# Altium schematic sheet mcuCore.SchDoc
size A4
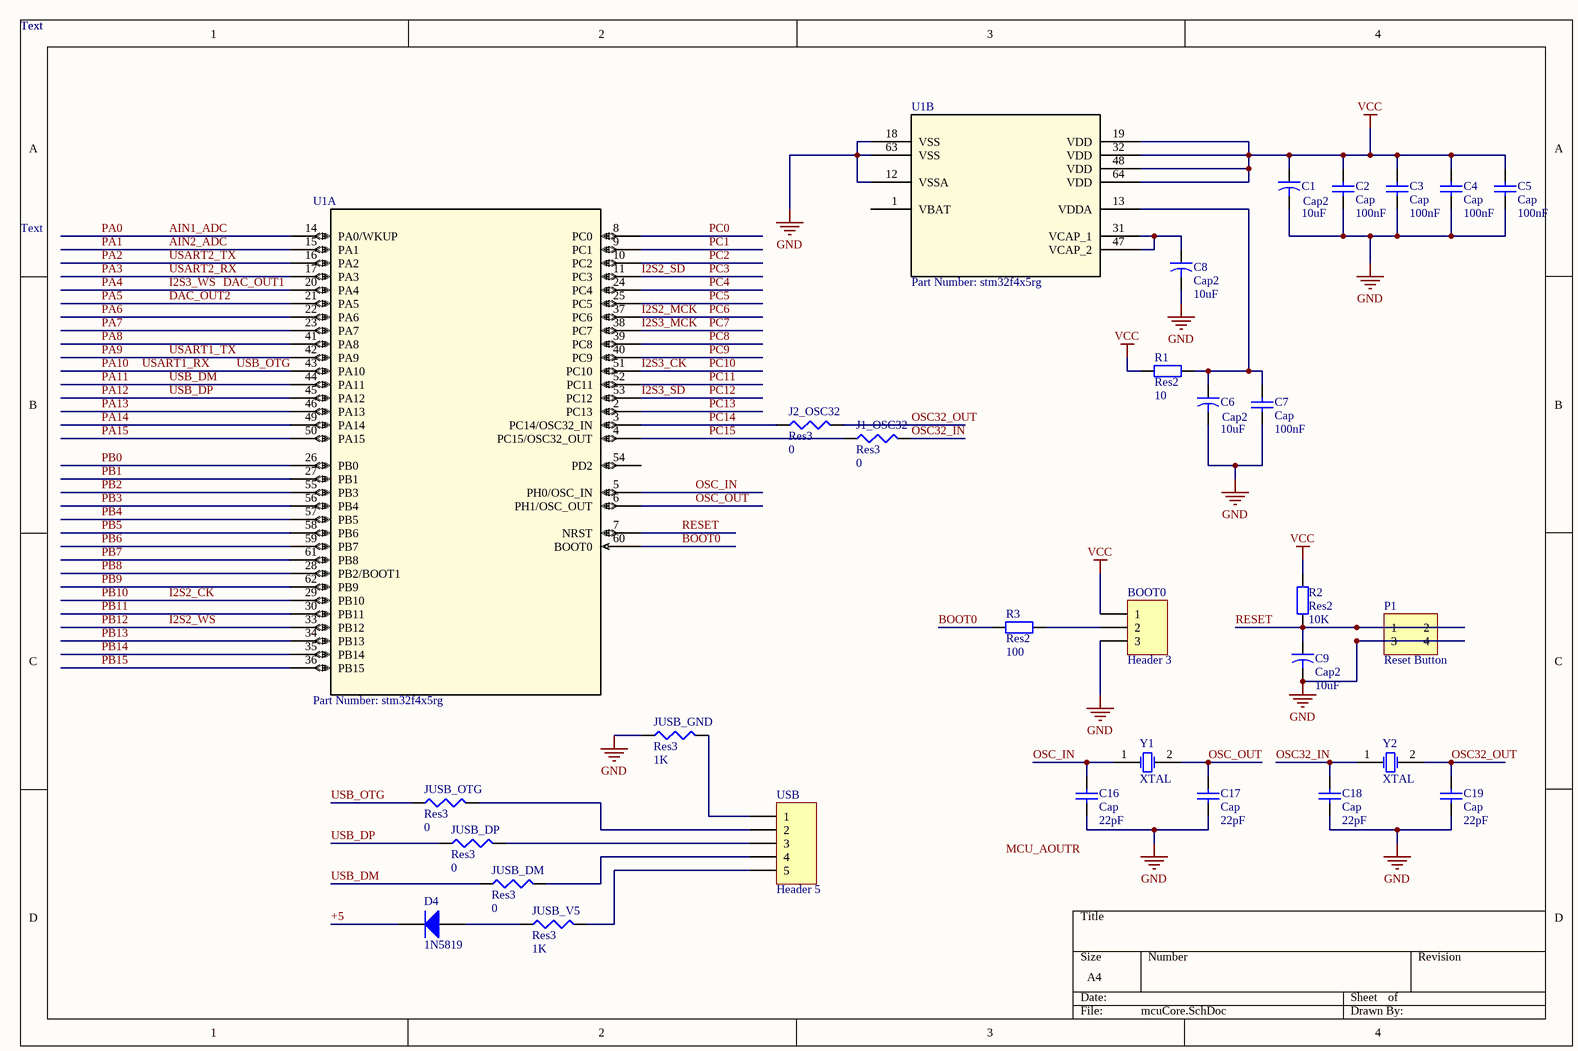
[diagram p0: mcuCore.SchDoc]

## Parts
BOOT0  Header 3  [HDR1X3]
C1  Cap2  value 10uF  [Cap5x10]
C2  Cap  value 100nF  [1608[0603]]
C3  Cap  value 100nF  [1608[0603]]
C4  Cap  value 100nF  [1608[0603]]
C5  Cap  value 100nF  [1608[0603]]
C6  Cap2  value 10uF  [Cap5x10]
C7  Cap  value 100nF  [1608[0603]]
C8  Cap2  value 10uF  [Cap5x10]
C9  Cap2  value 10uF  [Cap5x10]
C16  Cap  value 22pF  [1608[0603]]
C17  Cap  value 22pF  [1608[0603]]
C18  Cap  value 22pF  [1608[0603]]
C19  Cap  value 22pF  [1608[0603]]
D4  1N5819  [425]
J1_OSC32  Res3  value 0  [JUMPER2]
J2_OSC32  Res3  value 0  [JUMPER2]
JUSB_DM  Res3  value 0  [JUMPER2]
JUSB_DP  Res3  value 0  [JUMPER2]
JUSB_GND  Res3  value 1K  [JUMPER2]
JUSB_OTG  Res3  value 0  [JUMPER2]
JUSB_V5  Res3  value 1K  [JUMPER2]
P1  Reset Button  [DC_Jack]
R1  Res2  value 10  [AXIAL-0.4]
R2  Res2  value 10K  [J1-0603]
R3  Res2  value 100  [J1-0603]
U1  Part Number: stm32f4x5rg  [LQFP64-10x10mm]  (parts A,B of 2)
USB  Header 5  [Micro_USB]
Y1  XTAL  [XTAL_8M]
Y2  XTAL  [XTAL_32k]

## Nets
GND: BOOT0.3 C1.2 C2.1 C3.1 C4.1 C5.1 C6.2 C7.1 C8.2 C9.2 C16.1 C17.1 C18.1 C19.1 JUSB_GND.1 P1.3 P1.4 U1.12(VSSA) U1.18(VSS) U1.63(VSS)
VCC: BOOT0.1 C1.1 C2.2 C3.2 C4.2 C5.2 R1.1 R2.2 U1.19(VDD) U1.32(VDD) U1.48(VDD) U1.64(VDD)
+5: D4.2(K)
AIN1_ADC: U1.14(PA0/WKUP)  [also labelled PA0]
AIN2_ADC: U1.15(PA1)  [also labelled PA1]
BOOT0: R3.1 U1.60(BOOT0)
DAC_OUT1: U1.20(PA4)  [also labelled I2S3_WS, PA4]
DAC_OUT2: U1.21(PA5)  [also labelled PA5]
I2S2_CK: U1.29(PB10)  [also labelled PB10]
I2S2_MCK: U1.37(PC6)  [also labelled PC6]
I2S2_SD: U1.11(PC3)  [also labelled PC3]
I2S2_WS: U1.33(PB12)  [also labelled PB12]
I2S3_CK: U1.51(PC10)  [also labelled PC10]
I2S3_MCK: U1.38(PC7)  [also labelled PC7]
I2S3_SD: U1.53(PC12)  [also labelled PC12]
OSC32_IN: C18.2 J1_OSC32.2 Y2.1(OSC1)
OSC32_OUT: C19.2 J2_OSC32.2 Y2.2(OSC2)
OSC_IN: C16.2 U1.5(PH0/OSC_IN) Y1.1(OSC1)
OSC_OUT: C17.2 U1.6(PH1/OSC_OUT) Y1.2(OSC2)
PA2: U1.16(PA2)  [also labelled USART2_TX]
PA3: U1.17(PA3)  [also labelled USART2_RX]
PA6: U1.22(PA6)
PA7: U1.23(PA7)
PA8: U1.41(PA8)
PA9: U1.42(PA9)  [also labelled USART1_TX]
PA10: JUSB_OTG.1 U1.43(PA10)  [also labelled USART1_RX, USB_OTG]
PA11: JUSB_DM.1 U1.44(PA11)  [also labelled USB_DM]
PA12: JUSB_DP.1 U1.45(PA12)  [also labelled USB_DP]
PA13: U1.46(PA13)
PA14: U1.49(PA14)
PA15: U1.50(PA15)
PB0: U1.26(PB0)
PB1: U1.27(PB1)
PB2: U1.55(PB3)
PB3: U1.56(PB4)
PB4: U1.57(PB5)
PB5: U1.58(PB6)
PB6: U1.59(PB7)
PB7: U1.61(PB8)
PB8: U1.28(PB2/BOOT1)
PB9: U1.62(PB9)
PB11: U1.30(PB11)
PB13: U1.34(PB13)
PB14: U1.35(PB14)
PB15: U1.36(PB15)
PC0: U1.8(PC0)
PC1: U1.9(PC1)
PC2: U1.10(PC2)
PC4: U1.24(PC4)
PC5: U1.25(PC5)
PC8: U1.39(PC8)
PC9: U1.40(PC9)
PC11: U1.52(PC11)
PC13: U1.2(PC13)
PC14: J2_OSC32.1 U1.3(PC14/OSC32_IN)
PC15: J1_OSC32.1 U1.4(PC15/OSC32_OUT)
RESET: C9.1 P1.1 P1.2 R2.1 U1.7(NRST)
NetBOOT0_2: BOOT0.2 R3.2
NetC6_1: C6.1 C7.2 R1.2 U1.13(VDDA)
NetC8_1: C8.1 U1.31(VCAP_1) U1.47(VCAP_2)
NetD4_1: D4.1(A) JUSB_V5.1
NetJUSB_DM_2: JUSB_DM.2 USB.4
NetJUSB_DP_2: JUSB_DP.2 USB.3
NetJUSB_GND_2: JUSB_GND.2 USB.1
NetJUSB_OTG_2: JUSB_OTG.2 USB.2
NetJUSB_V5_2: JUSB_V5.2 USB.5

Not connected (* = marked no-connect by the designer): U1 1(VBAT) 54(PD2)

## Notes on the sheet
- Text
- Labels drawn without touching a wire or pin: MCU_AOUTR

## Library data of the parts
BOOT0 = Header 3: Header, 3-Pin; LatestRevisionDate: 17-Jul-2002; LatestRevisionNote: Re-released for DXP Platform.; Publisher: Altium Limited
C1 C6 C8 C9 = Cap2: Capacitor; Published: 23-Sep-2002; PackageReference: CAPR5-4X5; Publisher: Altium Limited; PackageDescription: Capacitor; 2 Leads
C2-C5 C7 C16-C19 = Cap: Capacitor; Published: 8-Jun-2000; LatestRevisionDate: 17-Jul-2002; LatestRevisionNote: Re-released for DXP Platform.; PackageReference: RAD-0.3; Publisher: Altium Limited; PackageDescription: Radial Cap, Thru-Hole; 2 Leads; 0.3 in Pin Spacing
D4 = Diode 1N4148: High Conductance Fast Diode; Published: 8-Jun-2000; LatestRevisionDate: 17-Jul-2002; LatestRevisionNote: Re-released for DXP Platform.; DatasheetVersion: 1997; PackageReference: DO-35; Publisher: Altium Limited; PackageDescription: Diode, Axial; Body 3.8 x 1.9 mm (LxDia. max), Lead Dia. 0.53 mm (max); Code_JEDEC: DO-204-AH; ComponentLink1Description: Manufacturer Link; ComponentLink1URL: http://www.fairchildsemi.com/; ComponentLink2Description: Datasheet; ComponentLink2URL: http://www.fairchildsemi.com/ds/1N%2F1N4148.pdf
J1_OSC32 J2_OSC32 JUSB_DM JUSB_DP JUSB_GND JUSB_OTG JUSB_V5 = Res3: Resistor; Published: 8-Jun-2000; LatestRevisionDate: 29-May-2009; LatestRevisionNote: IPC-7351 Footprint Added.; PackageReference: J1-0603; Publisher: Altium Limited; PackageDescription: Chip Resistor
P1 = Header 2X2: Header, 2-Pin, Dual row; LatestRevisionDate: 17-Jul-2002; LatestRevisionNote: Re-released for DXP Platform.; Publisher: Altium Limited
R1-R3 = Res2: Resistor; Published: 8-Jun-2000; LatestRevisionDate: 17-Jul-2002; LatestRevisionNote: Re-released for DXP Platform.; PackageReference: AXIAL-0.4; Publisher: Altium Limited; PackageDescription: Axial Device, Thru-Hole; 2 Leads; 0.4 in Pin Spacing
U1 = STM32F4x5RG: No Description Available; Vendor: STMicroelectronics; Manufacturer_Part_Number: stm32f4x5rg; Copyright: Copyright (C) 2016 Accelerated Designs. All rights reserved; RefDes: RefDes; Type: DEV; Value: Value
USB = Header 5: Header, 5-Pin; LatestRevisionDate: 17-Jul-2002; LatestRevisionNote: Re-released for DXP Platform.; Publisher: Altium Limited
Y1 Y2 = XTAL: Crystal Oscillator; Published: 8-Jun-2000; LatestRevisionDate: 17-Jul-2002; LatestRevisionNote: Re-released for DXP Platform.; PackageReference: R38; Publisher: Altium Limited; PackageDescription: Crystal, Thru-Hole; 2 Leads; Body 3.1 x 8.2 mm (Dia.xH)